# EAGLE design pcie-led-high (EAGLE 7.6.0)

## Sheet 1 of 2
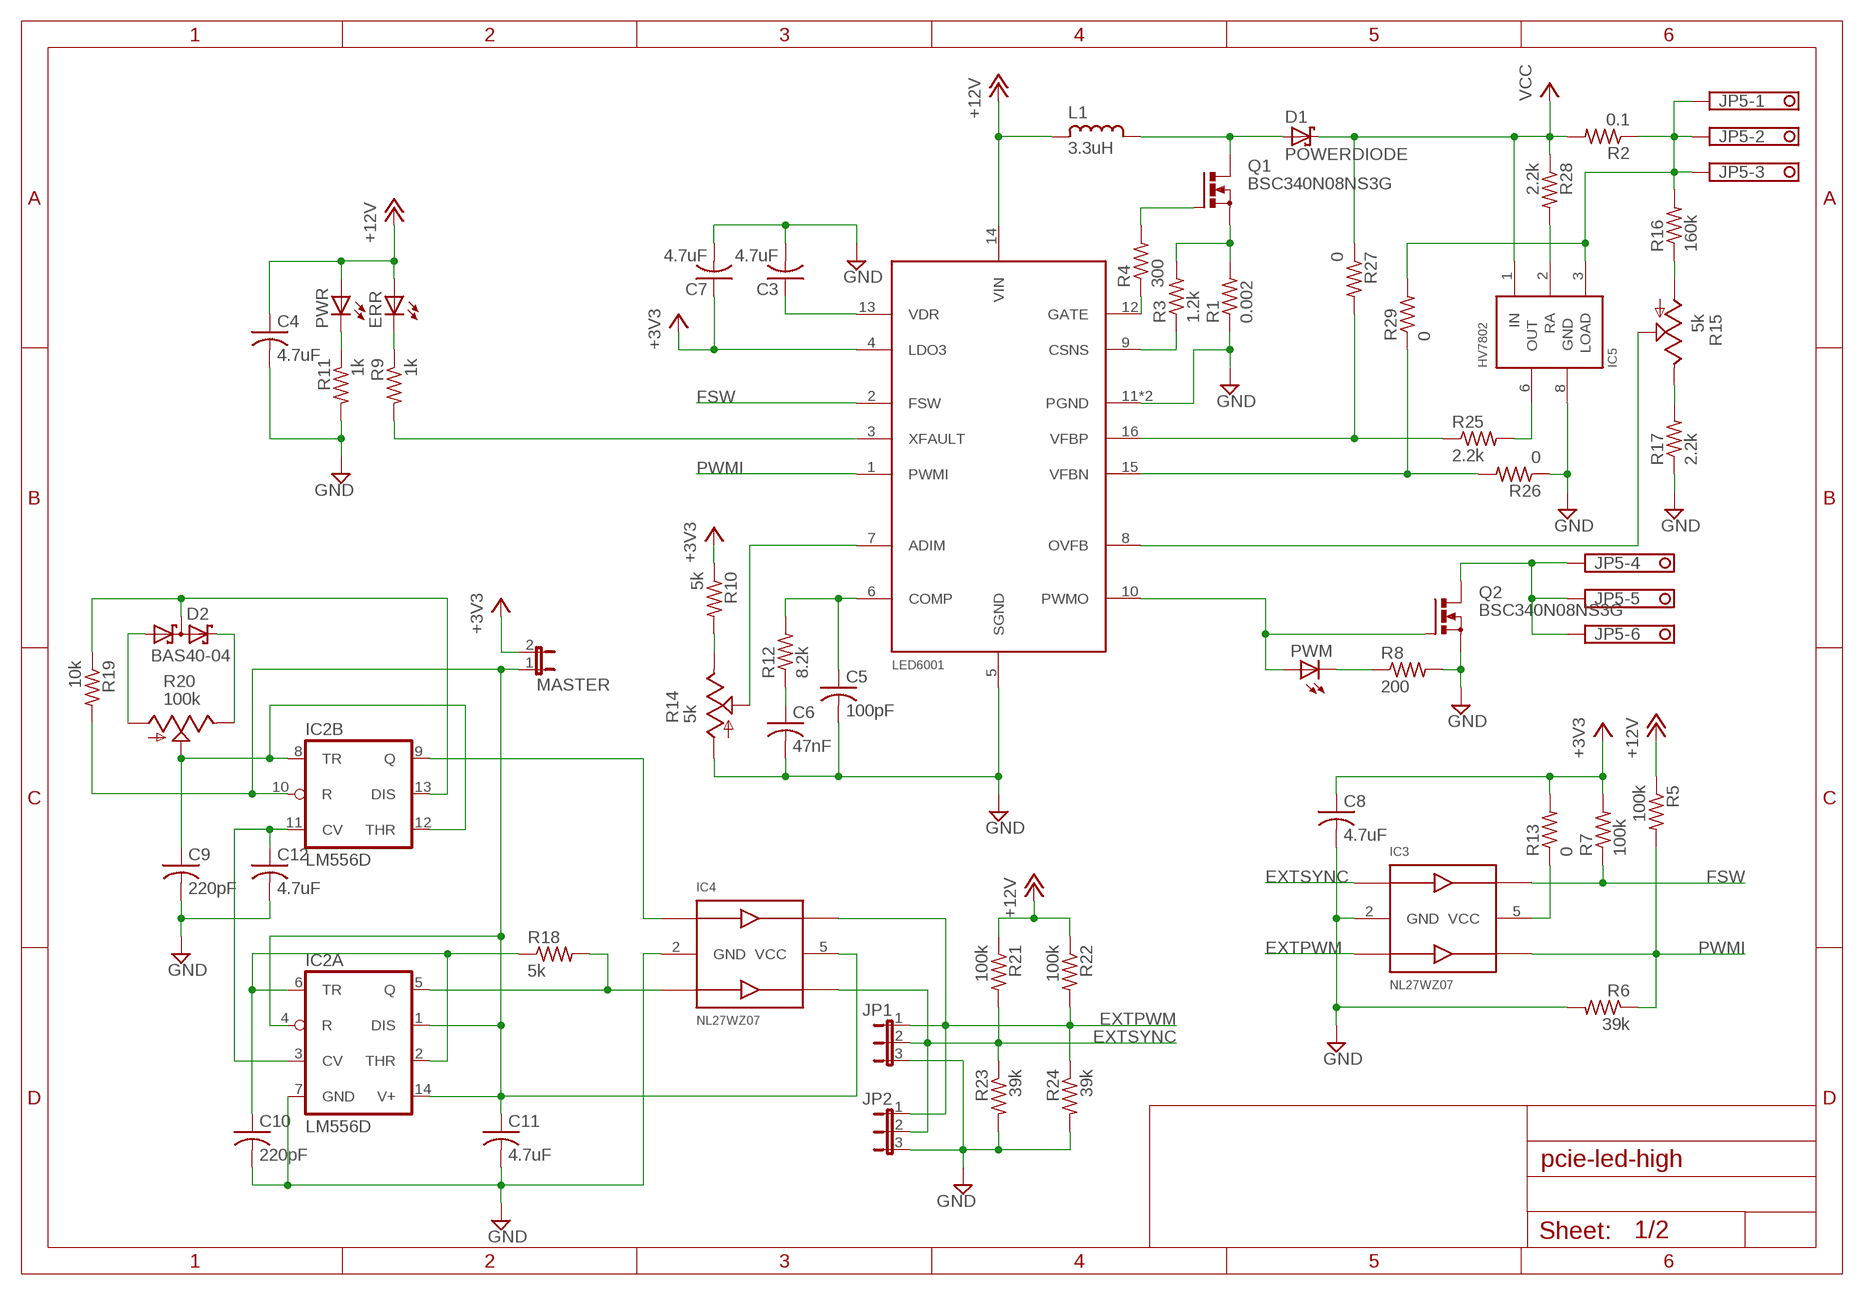
[diagram p0: schematic, sheet 1]

### Parts
C3  4.7uF  C-USC0603  [C0603]
C4  4.7uF  C-USC0603  [C0603]
C5  100pF  C-USC0603  [C0603]
C6  47nF  C-USC0603  [C0603]
C7  4.7uF  C-USC0603  [C0603]
C8  4.7uF  C-USC0603  [C0603]
C9  220pF  C-USC0603  [C0603]
C10  220pF  C-USC0603  [C0603]
C11  4.7uF  C-USC0603  [C0603]
C12  4.7uF  C-USC0603  [C0603]
D1  POWERDIODE  [LFPACK56-TO277]
D2  BAS40-04  [SOT23]
ERR  LEDCHIP-LED0805  [CHIP-LED0805]
IC1  LED6001  [HTSSOP-16]
IC2  LM556D  [SO14]
IC3  NL27WZ07  [SOT363]
IC4  NL27WZ07  [SOT363]
IC5  HV7802  [MSOP08]
JP1  JP2E  [JP2]
JP2  JP2E  [JP2]
JP5  OSTTE06  [OSTTE06]
L1  3.3uH  SRP1770TA  [SRP1770TA]
MASTER  JP1E  [JP1]
PWM  LEDCHIP-LED0805  [CHIP-LED0805]
PWR  LEDCHIP-LED0805  [CHIP-LED0805]
Q1  BSC340N08NS3G  [PG-TDSON-8]
Q2  BSC340N08NS3G  [PG-TDSON-8]
R1  0.002  R-US_R1206  [R1206]
R2  0.1  R-US_R2512  [R2512]
R3  1.2k  R-US_R0603  [R0603]
R4  300  R-US_R0603  [R0603]
R5  100k  R-US_R0603  [R0603]
R6  39k  R-US_R0603  [R0603]
R7  100k  R-US_R0603  [R0603]
R8  200  R-US_R0603  [R0603]
R9  1k  R-US_R0603  [R0603]
R10  5k  R-US_R0603  [R0603]
R11  1k  R-US_R0603  [R0603]
R12  8.2k  R-US_R0603  [R0603]
R13  0  R-US_R0603  [R0603]
R14  5k  ST4ETB  [ST-4EB]
R15  5k  ST4ETB  [ST-4EB]
R16  160k  R-US_R0603  [R0603]
R17  2.2k  R-US_R0603  [R0603]
R18  5k  R-US_R0603  [R0603]
R19  10k  R-US_R0603  [R0603]
R20  100k  P260T  [P260T]
R21  100k  R-US_R0603  [R0603]
R22  100k  R-US_R0603  [R0603]
R23  39k  R-US_R0603  [R0603]
R24  39k  R-US_R0603  [R0603]
R25  2.2k  R-US_R0603  [R0603]
R26  0  R-US_R0603  [R0603]
R27  0  R-US_R0603  [R0603]
R28  2.2k  R-US_R0603  [R0603]
R29  0  R-US_R0603  [R0603]

### Nets
+3V3: C7.1 C8.1 IC1.4(LDO3) MASTER.2 R7.2 R10.1 R13.2
+12V: C4.1 ERR.A IC1.14(VIN) L1.P$1 PWR.A R5.1 R21.1 R22.1 ; also sheet 2
CSNS: Q1.1(S) Q1.2(S) Q1.3(S) R1.2 R3.2
EXTPWM: IC3.3(IN2) IC4.6(OUT1) JP1.1 JP2.1 R22.2 R24.1
EXTSYNC: IC3.1(IN1) IC4.4(OUT2) JP1.2 JP2.2 R21.2 R23.1
FSW: IC1.2(FSW) IC3.6(OUT1) R7.1
GND: C3.2 C4.2 C5.2 C6.2 C7.2 C8.2 C9.2 C10.2 C11.2 C12.2 IC1.5(SGND) IC1.11(PGND) IC1.PAD(PGND) IC2.7(A:GND) IC3.2(GND) IC4.2(GND) IC5.8(GND) JP1.3 JP2.3 Q2.1(S) Q2.2(S) Q2.3(S) R1.1 R6.2 R8.2 R11.2 R14.1(A) R17.1 R23.2 R24.2 R26.1 ; also sheet 2
L+: D1.A L1.P$2 Q1.5(D) Q1.6(D) Q1.7(D) Q1.8(D) Q1.TH(D)
LED+: IC5.3(LOAD) JP5.1 JP5.2 JP5.3 R2.1 R16.2 R29.2
LED-: JP5.4 JP5.5 JP5.6 Q2.5(D) Q2.6(D) Q2.7(D) Q2.8(D) Q2.TH(D)
N$1: PWM.C R8.1
N$2: IC1.10(PWMO) PWM.A Q2.4(G)
N$3: Q1.4(G) R4.2
N$4: C11.1 IC2.1(A:DIS) IC2.4(A:R) IC2.10(B:R) IC2.14(A:V+) IC4.5(VCC) MASTER.1 R19.2
N$5: IC1.12(GATE) R4.1
N$6: IC2.5(A:Q) IC4.3(IN2) R18.2
N$7: R15.1(A) R16.1
N$8: IC2.9(B:Q) IC4.1(IN1)
N$9: C5.1 IC1.6(COMP) R12.2
N$10: C6.1 R12.1
N$11: IC1.8(OVFB) R15.2(S)
N$12: IC1.7(ADIM) R14.2(S)
N$13: R15.3(E) R17.2
N$14: R10.2 R14.3(E)
N$15: IC1.9(CSNS) R3.1
N$16: IC3.5(VCC) R13.1
N$17: IC5.6(OUT) R25.2
N$18: C12.1 IC2.3(A:CV) IC2.11(B:CV)
N$19: IC5.2(RA) R28.2
N$20: IC1.15(VFBN) R26.2 R29.1
N$21: C10.1 IC2.2(A:THR) IC2.6(A:TR) R18.1
N$22: ERR.C R9.1
N$23: D2.2(C2) R20.3(E)
N$24: D2.1(A1) R20.1(A)
N$25: C9.1 IC2.8(B:TR) IC2.12(B:THR) R20.2(S)
N$26: D2.3(C1A2) IC2.13(B:DIS) R19.1
N$27: PWR.C R11.1
N$29: C3.1 IC1.13(VDR)
PWMI: IC1.1(PWMI) IC3.4(OUT2) R5.2 R6.1
VCC: D1.C1(C) D1.C2(C) D1.C3(C) D1.C4(C) D1.TH(C) IC5.1(IN) R2.2 R27.1 R28.1 ; also sheet 2
VFBP: IC1.16(VFBP) R25.1 R27.2
XFAULT: IC1.3(XFAULT) R9.2

## Sheet 2 of 2
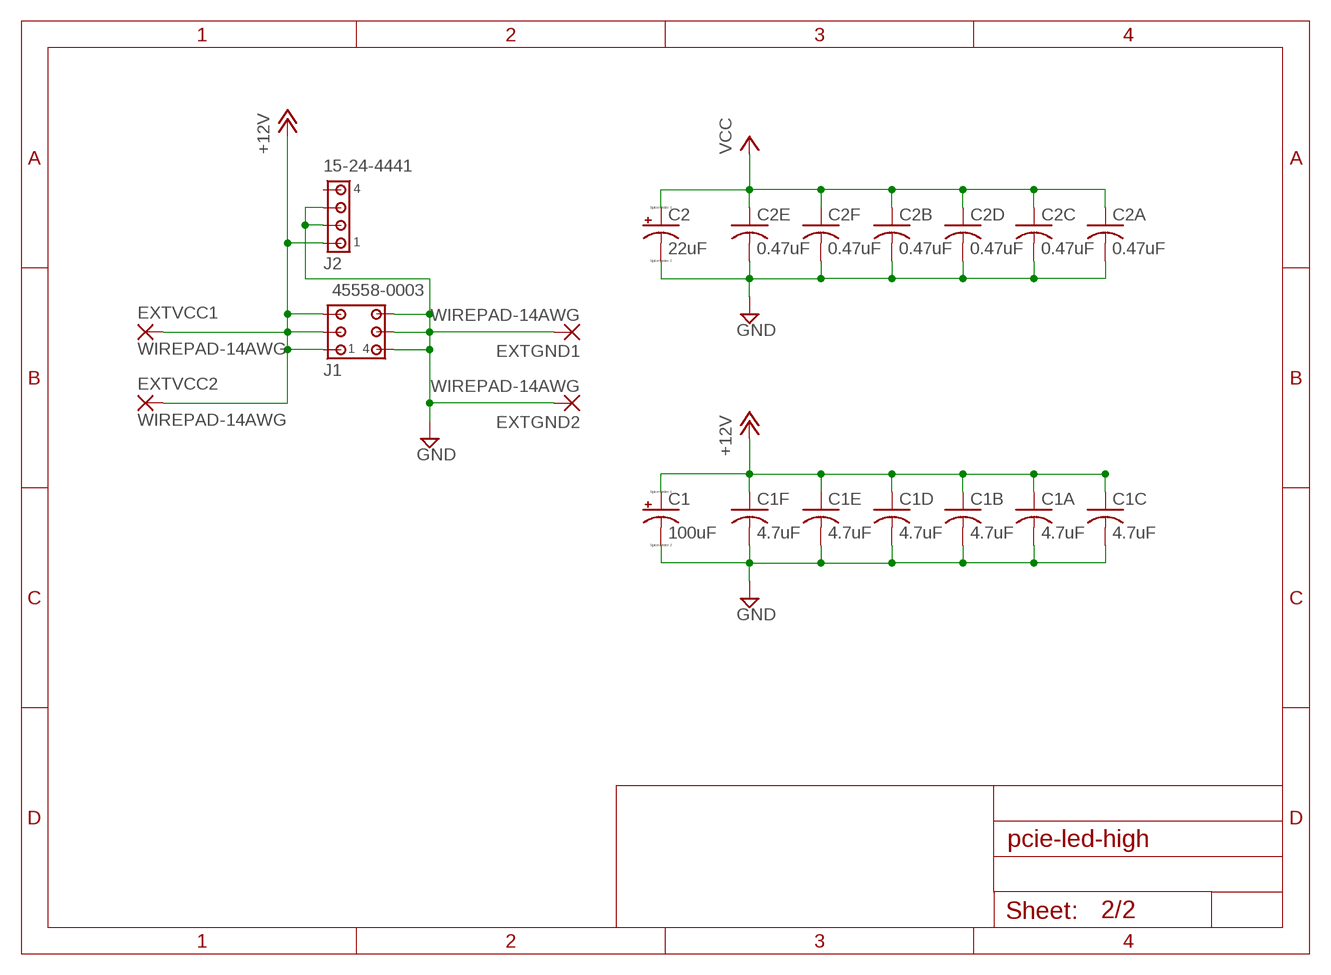
[diagram p1: schematic, sheet 2]

### Parts
C1  100uF  CPOL-USE3.5-8  [E3,5-8]
C1A  4.7uF  C-USC0805  [C0805]
C1B  4.7uF  C-USC0805  [C0805]
C1C  4.7uF  C-USC0805  [C0805]
C1D  4.7uF  C-USC0805  [C0805]
C1E  4.7uF  C-USC0805  [C0805]
C1F  4.7uF  C-USC0805  [C0805]
C2  22uF  CPOL-USE3.5-8  [E3,5-8]
C2A  0.47uF  C-USC0805  [C0805]
C2B  0.47uF  C-USC0805  [C0805]
C2C  0.47uF  C-USC0805  [C0805]
C2D  0.47uF  C-USC0805  [C0805]
C2E  0.47uF  C-USC0805  [C0805]
C2F  0.47uF  C-USC0805  [C0805]
EXTGND1  WIREPAD-14AWG  [WIREPAD-14AWG]
EXTGND2  WIREPAD-14AWG  [WIREPAD-14AWG]
EXTVCC1  WIREPAD-14AWG  [WIREPAD-14AWG]
EXTVCC2  WIREPAD-14AWG  [WIREPAD-14AWG]
J1  45558-0003  [45558-0003]
J2  15-24-4441  [15-24-4441]

### Nets
+12V: C1.+ C1A.1 C1B.1 C1C.1 C1D.1 C1E.1 C1F.1 EXTVCC1.TP(P) EXTVCC2.TP(P) J1.1 J1.2 J1.3 J2.1 ; also sheet 1
GND: C1.- C1A.2 C1B.2 C1C.2 C1D.2 C1E.2 C1F.2 C2.- C2A.2 C2B.2 C2C.2 C2D.2 C2E.2 C2F.2 EXTGND1.TP(P) EXTGND2.TP(P) J1.4 J1.5 J1.6 J2.2 J2.3 ; also sheet 1
VCC: C2.+ C2A.1 C2B.1 C2C.1 C2D.1 C2E.1 C2F.1 ; also sheet 1
Unconnected: J2.4

## Library data of the parts
C1 C2 = resistor:CPOL-US: POLARIZED CAPACITOR, American symbol
C1A C1B C1C C1D C1E C1F C2A C2B C2C C2D C2E C2F C3-C12 = resistor:C-US: CAPACITOR, American symbol
D1 = parts:POWERDIODE
D2 = diode:BAS40-04: Silicon Schottky Diodes General-purpose diode for high-speed switching
ERR PWM PWR = led:LED: LED OSRAM: - CHIPLED LG R971, LG N971, LY N971, LG Q971, LY Q971, LO R971, LY R971 LH N974, LH R974 LS Q976, LO Q976, LY Q976 LO Q996 - Hyper CHIPLED LW Q18S LB Q993, LB Q99A, LB R99A - SideLED LS A670, LO A670, LY A670, LG A670, LP A670 LB A673, LV A673, LT A673, LW A673 LH A674 LY A675 LS A676, LA A676, LO A676, LY A676, LW A676 LS A679, LY A679, LG A679 - Hyper Micro SIDELED® LS Y876, LA Y876, LO Y876, LY Y876 LT Y87S - SmartLED LW L88C, LW L88S LB L89C, LB L89S, LG L890 LS L89K, LO L89K, LY L89K LS L896, LA L896, LO L896, LY L896 - TOPLED LS T670, LO T670, LY T670, LG T670, LP T670 LSG T670, LSP T670, LSY T670, LOP T670, LYG T670 LG T671, LOG T671, LSG T671 LB T673, LV T673, LT T673, LW T673 LH T674 LS T676, LA T676, LO T676, LY T676, LB T676, LH T676, LSB T676, LW T676 LB T67C, LV T67C, LT T67C, LS T67K, LO T67K, LY T67K, LW E67C LS E67B, LA E67B, LO E67B, LY E67B, LB E67C, LV E67C, LT E67C LW T67C LS T679, LY T679, LG T679 LS T770, LO T770, LY T770, LG T770, LP T770 LB T773, LV T773, LT T773, LW T773 LH T774 LS E675, LA E675, LY E675, LS T675 LS T776, LA T776, LO T776, LY T776, LB T776 LHGB T686 LT T68C, LB T68C - Hyper Mini TOPLED® LB M676 - Mini TOPLED Santana® LG M470 LS M47K, LO M47K, LY M47K Source: http://www.osram.convergy.de LUXEON: - LUMILED® LXK2-PW12-R00, LXK2-PW12-S00, LXK2-PW14-U00, LXK2-PW14-V00 LXK2-PM12-R00, LXK2-PM12-S00, LXK2-PM14-U00 LXK2-PE12-Q00, LXK2-PE12-R00, LXK2-PE12-S00, LXK2-PE14-T00, LXK2-PE14-U00 LXK2-PB12-K00, LXK2-PB12-L00, LXK2-PB12-M00, LXK2-PB14-N00, LXK2-PB14-P00, LXK2-PB14-Q00 LXK2-PR12-L00, LXK2-PR12-M00, LXK2-PR14-Q00, LXK2-PR14-R00 LXK2-PD12-Q00, LXK2-PD12-R00, LXK2-PD12-S00 LXK2-PH12-R00, LXK2-PH12-S00 LXK2-PL12-P00, LXK2-PL12-Q00, LXK2-PL12-R00 Source: www.luxeon.com KINGBRIGHT: KA-3528ASYC Source: www.kingbright.com
EXTGND1 EXTGND2 EXTVCC1 EXTVCC2 = parts:WIREPAD-14AWG
IC1 = parts:LED6001: PWM-dimmable single channel LED driver with integrated boost controller
IC2 = linear:*556: Dual TIMER
IC3 IC4 = parts:NL27WZ07
IC5 = parts:HV7802
J1 = parts:45558-0003: Mini-Fit® Jr™ 45558 6 Positions Header, Shrouded Connector 0.165" (4.20mm) Through Hole, Right Angle Tin
J2 = parts:15-24-4441: 4 Positions Header, Shrouded Connector 0.200" (5.08mm) Through Hole, Right Angle Tin
JP1 JP2 = parts:JP2E: JUMPER
JP5 = parts:OSTTE06
L1 = parts:SRP1770TA: SRP1770TA Series - Shielded Power Inductors
MASTER = parts:JP1E: JUMPER
Q1 Q2 = parts:BSC340N08NS3G: OptiMOS TM 3 Power-Transistor BSC340N08NS3 G Source: Data sheet <http://www.infineon.com/dgdl/BSC340N08NS3G_rev2.4.pdf?folderId=db3a304313b8b5a60113cee8763b02d7&fileId=db3a30431add1d95011ae81c21f2563a>
R1-R13 R16-R19 R21-R29 = resistor:R-US_: RESISTOR, American symbol
R14 R15 = parts:ST4ETB
R20 = parts:P260T

## Board
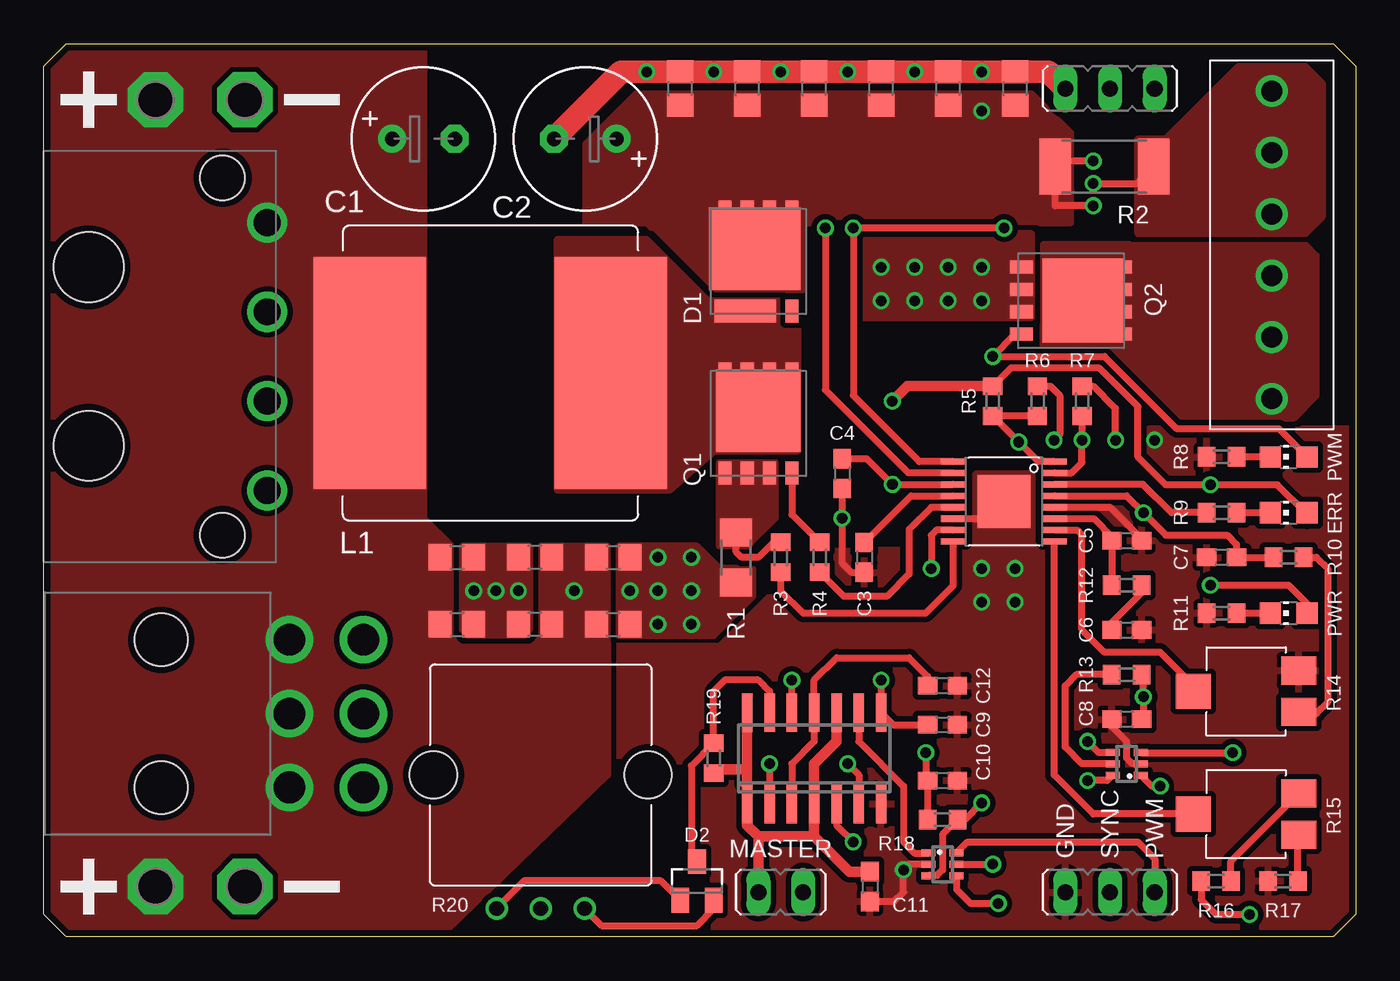
[diagram p2: board, top side]
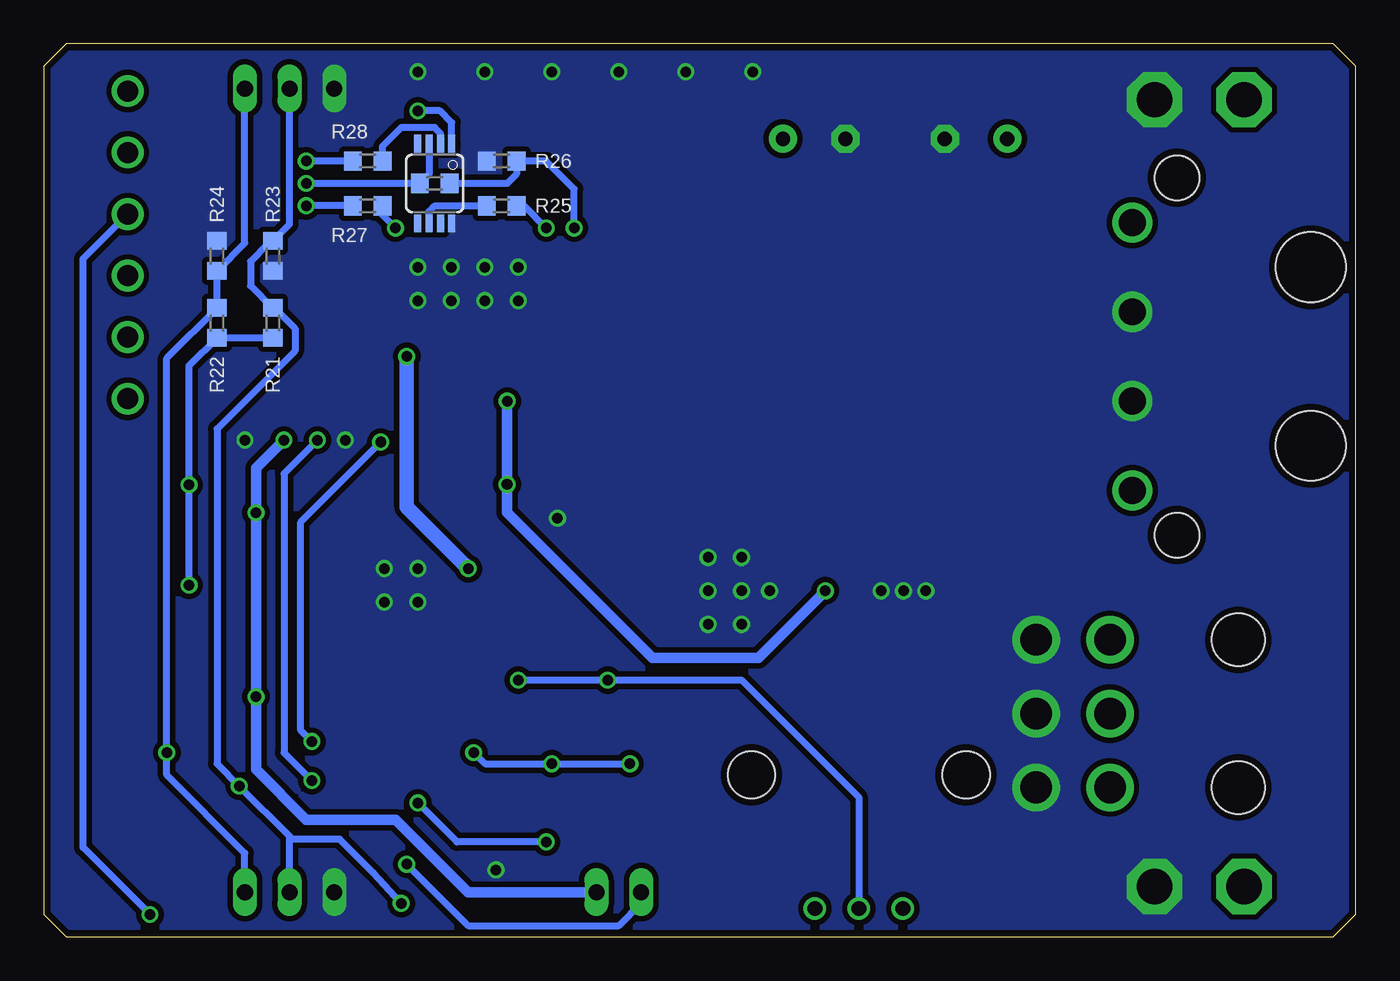
[diagram p3: board, bottom side, seen from below]

Size 74.61 x 50.8 mm. Coordinates in mm from the lower left corner, seen from the top.
Outline: 1.27,0 0,1.27 0,49.53 1.27,50.8 73.34,50.8 74.61,49.53 74.61,1.27 73.34,0 1.27,0
Copper layers (1*16): Top 0.0356mm / dielectric 1.5011mm / Bottom 0.0356mm
Design rules "oshpark-2layer": minimum track width 6mil, minimum drill 13mil, track to track 6mil, track to pad 6mil, pad to pad 6mil, via to via 6mil, smd to smd 6mil, copper to edge 15mil, drill to drill 6mil, minimum pad ring 7mil, minimum via ring 7mil, stop-mask expansion 2.5mil, vias tented up to drill 0mil, thermal gap 10mil

### Footprints (pad centres in the part's own frame; a part is rotated, then mirrored left to right if it is on the bottom)
E3,5-8 = drill 0.813 pad 1.6: + -1.778,0 | drill 0.813 pad 1.6 octagon: - 1.778,0
C0805 = smd 1.3 x 1.5: 1 -0.95,0; 2 0.95,0
C0603 = smd 1.1 x 1: 1 -0.85,0; 2 0.85,0
LFPACK56-TO277 = smd 1.3 x 3.5: A -2.825,0.735 | smd 1.3 x 0.75: C1 2.825,1.905; C2 2.825,0.635; C3 2.825,-0.635; C4 2.825,-1.905; NC -2.825,-1.905 | smd 4.7 x 5.2: TH 0.725,0.2
SOT23 = smd 1 x 1.4: 1 -0.95,-1.1; 2 0.95,-1.1; 3 0,1.1
CHIP-LED0805 = smd 1.2 x 1.2: A 0,-1.05; C 0,1.05
WIREPAD-14AWG = drill 2.007 pad 3.15 octagon: TP 0,0
HTSSOP-16 = smd 0.35 x 1.4: 1 -2.275,2.875; 2 -1.625,2.875; 3 -0.975,2.875; 4 -0.325,2.875; 5 0.325,2.875; 6 0.975,2.875; 7 1.625,2.875; 8 2.275,2.875; 9 2.275,-2.875; 10 1.625,-2.875; 11 0.975,-2.875; 12 0.325,-2.875; 13 -0.325,-2.875; 14 -0.975,-2.875; 15 -1.625,-2.875; 16 -2.275,-2.875 | smd 3 x 3: PAD 0,0
SO14 = smd 0.6 x 2.2: 1 -3.81,-2.6; 2 -2.54,-2.6; 3 -1.27,-2.6; 4 0,-2.6; 5 1.27,-2.6; 6 2.54,-2.6; 7 3.81,-2.6; 8 3.81,2.6; 9 2.54,2.6; 10 1.27,2.6; 11 0,2.6; 12 -1.27,2.6; 13 -2.54,2.6; 14 -3.81,2.6
SOT363 = smd 0.4 x 0.8: 1 -0.65,-0.8; 2 0,-0.8; 3 0.65,-0.8; 4 0.65,0.8; 5 0,0.8; 6 -0.65,0.8
MSOP08 = smd 0.4 x 1: 1 -0.976,-2.263; 2 -0.326,-2.263; 3 0.324,-2.263; 4 0.974,-2.263; 5 0.974,2.262; 6 0.324,2.262; 7 -0.326,2.262; 8 -0.976,2.262
45558-0003 = drill 1.8: 1 -4.2,0; 2 0,0; 3 4.2,0; 4 -4.2,-4.2; 5 0,-4.2; 6 4.2,-4.2 | hole 3: 4.2,7.3; -4.2,7.3
15-24-4441 = drill 1.524: 1 7.62,-5.08; 2 2.54,-5.08; 3 -2.54,-5.08; 4 -7.62,-5.08 | hole 2.54: 10.16,-2.54; -10.16,-2.54 | hole 3.988: 5.08,5.08; -5.08,5.08
JP2 = drill 0.914 long: 1 -2.54,0; 2 0,0; 3 2.54,0
OSTTE06 = drill 1.2: 1 -8.75,0; 2 -5.25,0; 3 -1.75,0; 4 1.75,0; 5 5.25,0; 6 8.75,0
SRP1770TA = smd 6.4 x 13.2: P$1 6.85,0; P$2 -6.85,0
JP1 = drill 0.914 long: 1 0,-1.27; 2 0,1.27
PG-TDSON-8 = smd 1.3 x 0.75: 1 -2.825,1.905; 2 -2.825,0.635; 3 -2.825,-0.635; 4 -2.825,-1.905; 5 2.825,-1.905; 6 2.825,-0.635; 7 2.825,0.635; 8 2.825,1.905 | smd 4.7 x 4.8: TH 0.725,0
R1206 = smd 1.6 x 1.803: 1 -1.422,0; 2 1.422,0
R2512 = smd 1.8 x 3.2: 1 -2.8,0; 2 2.8,0
R0603 = smd 1 x 1.1: 1 -0.85,0; 2 0.85,0
ST-4EB = smd 2 x 1.6: 1 2.8,1.175; 3 2.8,-1.175 | smd 2 x 2: 2 -3.2,0
P260T = drill 0.85: 1 -2.5,-7.6; 2 0,-7.6; 3 2.5,-7.6 | hole 2.7: -6.1,0; 6.1,0

### Placement (x,y rotation side)
C1  21.59,45.4 0 top
C1A  23.5,21.59 0 top
C1B  23.5,17.78 0 top
C1C  27.94,21.59 180 top
C1D  27.94,17.78 180 top
C1E  32.38,21.59 0 top
C1F  32.38,17.78 0 top
C2  30.8,45.4 180 top
C2A  36.2,48.26 90 top
C2B  40.01,48.26 90 top
C2C  43.81,48.26 90 top
C2D  47.62,48.26 90 top
C2E  51.44,48.26 90 top
C2F  55.24,48.26 90 top
C3  46.67,21.59 270 top
C4  45.4,26.35 270 top
C5  61.59,22.54 0 top
C6  61.59,17.46 0 top
C7  66.99,21.59 180 top
C8  61.59,12.38 180 top
C9  51.12,12.06 0 top
C10  51.12,8.89 0 top
C11  46.99,2.86 270 top
C12  51.12,14.29 0 top
D1  40.64,38.42 90 top
D2  37.15,3.17 0 top
ERR  70.8,24.13 90 top
EXTGND1  11.43,2.86 0 top
EXTGND2  11.43,47.62 0 top
EXTVCC1  6.35,2.86 0 top
EXTVCC2  6.35,47.62 0 top
IC1  54.61,24.77 270 top
IC2  43.81,10.16 0 top
IC3  61.59,9.84 90 top
IC4  51.12,4.13 270 top
IC5  52.39,42.86 180 bottom
J1  13.97,12.7 90 top
J2  7.62,33.02 90 top
JP1  60.64,48.26 180 top
JP2  60.64,2.54 180 top
JP5  69.85,39.37 270 top
L1  25.4,32.07 180 top
MASTER  41.91,2.54 270 top
PWM  70.8,27.3 90 top
PWR  70.8,18.41 90 top
Q1  40.64,29.21 90 top
Q2  58.42,36.2 0 top
R1  39.37,21.59 90 top
R2  60.33,43.81 180 top
R3  41.91,21.59 90 top
R4  44.13,21.59 90 top
R5  53.98,30.48 270 top
R6  56.52,30.48 90 top
R7  59.05,30.48 90 top
R8  66.99,27.3 180 top
R9  66.99,24.13 180 top
R10  70.8,21.59 0 top
R11  66.99,18.41 180 top
R12  61.59,20 180 top
R13  61.59,14.92 0 top
R14  68.58,13.97 0 top
R15  68.58,6.99 0 top
R16  66.67,3.17 180 top
R17  70.48,3.17 0 top
R18  51.12,6.67 0 top
R19  38.1,10.16 270 top
R20  28.26,9.21 0 top
R21  61.59,34.92 90 bottom
R22  64.77,34.92 90 bottom
R23  61.59,38.73 270 bottom
R24  64.77,38.73 90 bottom
R25  48.58,41.59 180 bottom
R26  48.58,44.13 0 bottom
R27  56.2,41.59 0 bottom
R28  56.2,44.13 0 bottom
R29  52.39,42.86 180 bottom

### Tracks (layer width: path | path; a pad name or v marks a point on that pad's centre or on a via)
+3V3  (via drill 0.6)
  Top 0.406: IC1.4 61.59,25.09 v62.55,24.13 63.82,22.86 67.31,22.86 67.84,22.33 C7.1 R10.1 | 59.16,31.33 R7.2 | 59.16,31.43 R7.2 | R7.2 59.69,31.33 60.96,30.06 v60.96,28.26 | C8.1 62.55,12.48 v62.55,13.65 62.55,14.82 R13.2
  Bottom 0.61: v60.96,28.26 62.55,26.67 v62.55,24.13 v62.55,13.65 62.55,9.53 59.69,6.67 54.61,6.67 50.48,2.54 MASTER.2
+12V  (via drill 0.6)
  Top 0.406: R5.1 55.03,32.38 60.01,32.38 62.23,30.16 62.23,27.3 63.82,25.72 v66.36,25.72 70.17,25.72 71.75,24.13 ERR.A 71.85,23.71 | PWR.A 71.85,18.95 70.8,20 v66.36,20 | 53.98,31.43 R5.1 | C4.1 46.8,27.2 v48.26,25.74 | R5.1 53.87,31.33 | v48.28,25.74 IC1.14
  Top 0.61: v48.26,30.48 49.11,31.33 R5.1
  Top 2.54: 18.92,35.69 L1.P$1
  Bottom 0.406: v66.36,20 v66.36,25.72 66.36,32.49 R22.1 R21.1
  Bottom 0.61: v30.16,19.68 33.97,15.88 40.01,15.88 48.26,24.13 v48.26,25.74 v48.28,25.74 48.26,25.76 v48.26,30.48
  pour Top (isolate 0.305, rank 2, no thermals): 32.07,22.23 32.07,9.21 22.86,0.32 0.32,0.32 0.32,50.48 21.59,50.48 21.59,23.81 23.18,22.23 23.18,17.14 23.81,16.51 27.62,16.51 28.26,17.14 28.26,22.23
CSNS
  Top 0.406: R3.2 41.49,22.44 40.64,21.59 39.69,21.59 39.37,21.91 R1.2
  pour Top (rank 2, no thermals): 38.42,26.99 41.59,26.99 41.59,23.81 40.01,22.23 38.42,22.23
EXTPWM  (via drill 0.6)
  Top 0.406: 63.18,2.86 JP2.1 63.18,4.45 62.23,5.4 52.54,5.4 IC4.6 | IC3.3 62.41,10.48 v67.63,10.48
  Bottom 0.406: JP2.1 63.18,4.76 67.63,9.21 v67.63,10.48 67.63,32.92 R22.2 R24.1 | R24.1 64.67,37.88 | R24.1 63.18,39.47 JP1.1
EXTSYNC  (via drill 0.6)
  Top 0.406: JP2.2 60.64,3.49 | IC3.1 63.02,8.57 v63.5,8.57 | IC4.4 51.92,2.69 52.7,1.91 v54.29,1.91
  Bottom 0.406: JP2.2 60.64,5.71 | 60.64,5.71 v63.5,8.57 64.77,9.84 64.77,28.89 60.33,33.34 60.33,34.61 61.49,35.77 R21.2 62.87,37.05 62.87,38.42 61.91,39.37 61.81,39.37 R23.1 60.64,40.54 JP1.2 | 60.64,5.71 60.48,5.56 57.78,5.56 55.88,3.65 v54.29,1.91
FSW  (via drill 0.6)
  Top 0.406: R7.1 v59.05,28.26 59.05,26.99 58.46,26.39 IC1.2 | 59.39,8.88 v59.37,8.89 60.49,8.89 IC3.6
  Bottom 0.406: v59.37,8.89 60.96,10.48 60.96,26.35 v59.05,28.26
GND  (via drill 0.6)
  Top 0.406: IC1.5 60.65,24.44 62.45,22.64 C5.2 | R6.2 57.25,31.33 57.78,30.8 57.78,28.57 v57.47,28.26 | IC3.2 61.91,9.84 61.59,10.16 61.59,11.11 60.74,11.96 C8.2 | IC4.2 49.21,4.13 v48.9,3.81 48.9,2.54 48.36,2.01 C11.2 | C4.2 v45.4,23.81 45.4,21.27 45.94,20.74 C3.2 | IC1.11 53.63,23.79 IC1.PAD
  Top 1.27: C2B.2 | JP1.3 57.15,49.21 C2F.2 C2E.2 C2D.2 C2C.2 C2B.2 | C2A.2 C2B.2 | C2.- 32.83,49.21 v34.29,49.21 C2A.2
  other vias: 34.92,21.59 36.83,21.59 36.83,19.68 36.83,17.78 34.92,17.78 34.92,19.68 33.34,19.68 24.45,19.68 25.72,19.68 26.99,19.68 53.34,20.95 55.24,20.95 55.24,19.05 53.34,19.05 63.18,28.26 38.1,49.21 41.91,49.21 45.72,49.21 49.53,49.21 53.34,49.21 47.62,38.1 49.53,38.1 51.44,38.1 53.34,38.1 53.34,36.2 51.44,36.2 49.53,36.2 47.62,36.2
  pour Top (isolate 0.305, no thermals): 40.32,20.95 38.42,20.95 37.15,22.23 32.7,22.23 32.7,17.14 38.1,17.14 40.32,19.37
  pour Top (rank 3, no thermals): 53.02,26.35 56.2,26.35 56.2,21.91 53.02,21.91
  pour Top (no thermals): 23.81,22.23 27.62,22.23 27.62,17.46 27.3,17.14 24.13,17.14 23.81,17.46
  pour Top (isolate 0.305, rank 3): 74.3,0.32 74.3,28.89 62.87,28.89 57.78,22.23 43.81,21.91 38.42,16.51 32.38,16.51 32.38,8.89 23.81,0.32
  pour Bottom (isolate 0.305, no thermals): 74.3,0.32 0.32,0.32 0.32,50.48 74.3,50.48
  pour Top (isolate 0.305, no thermals): 56.2,35.24 56.2,40.01 46.35,40.01 46.35,35.24
L+
  pour Top (isolate 0.305, no thermals): 42.86,36.2 42.86,27.62 38.1,27.62 35.56,25.4 29.21,25.4 29.21,39.69 34.29,39.69 37.78,36.2
LED+  (via drill 0.6)
  Top 0.406: v59.69,42.86 62.17,42.86 R2.1 | R16.2 65.83,2.12 66.67,1.27 v68.58,1.27
  Bottom 0.406: IC5.3 52.71,43.39 R29.2 v59.69,42.86 | v68.58,1.27 72.39,5.08 72.39,38.58 JP5.3
  pour Top (isolate 0.305, no thermals): 62.23,45.4 63.82,45.4 67.94,49.53 71.75,49.53 72.71,48.58 72.71,40.96 71.75,40.01 62.23,40.01
LED-
  pour Top (isolate 0.305, rank 2, no thermals): 56.83,39.37 56.83,29.53 71.12,29.53 72.39,30.8 72.39,38.73 71.75,39.37
N$1
  Top 0.406: PWM.C R8.1
N$2  (via drill 0.6)
  Top 0.406: PWM.A 70.27,28.89 64.45,28.89 60.33,33.02 v53.98,33.02 55.24,34.29 Q2.4 | IC1.10 50.76,23.14 50.48,22.86 v50.48,20.95
  Bottom 0.813: v53.98,33.02 53.98,24.45 v50.48,20.95
N$3
  Top 0.406: Q1.4 42.55,24.03 R4.2
N$4  (via drill 0.6)
  Top 0.406: 39.79,8.68 40.01,8.89 | 39.96,12.8 IC2.14 | C11.1 46.67,3.39 | IC4.5 v53.98,4.13
  Top 0.61: IC2.14 40.01,9.53 | 40.01,9.53 40.01,8.89 IC2.1 40.01,6.35 40.64,5.71 | 43.81,5.71 40.64,5.71 | IC2.10 45.09,11.11 43.81,9.84 IC2.4 43.81,5.71 | MASTER.1 40.64,5.71 | 43.81,5.71 45.82,3.71 C11.1 | R19.2 38.31,9.53 40.01,9.53
  Bottom 0.406: v53.98,4.13 50.48,0.64 41.91,0.64 40.64,1.91 MASTER.1
N$5
  Top 0.406: IC1.12 50.48,24.44 49.21,23.18 49.21,20.64 47.94,19.37 45.51,19.37 R4.1
N$6  (via drill 0.6)
  Top 0.406: IC4.3 50.33,3.49 50.8,3.49 51.12,3.81 51.12,5.82 R18.2 52.39,6.67 v53.34,7.62 | IC2.5 45.09,6.35 v46.04,5.4
  Bottom 0.406: v46.04,5.4 51.12,5.4 v53.34,7.62
N$7
  Top 0.406: R16.1 67.53,4.3 R15.1
N$8
  Top 0.406: IC2.9 46.35,11.11 48.9,8.57 48.9,5.4 49.53,4.76 50.3,4.76 IC4.1
N$9
  Top 0.406: IC1.6 59.71,23.79 60.74,22.76 C5.1 R12.2
N$10
  Top 0.406: C6.1 60.74,17.88 62.45,19.58 R12.1
N$11
  Top 0.406: R15.2 59.69,6.99 57.47,9.21 57.47,21.2 IC1.8
N$12
  Top 0.406: IC1.7 58.77,23.14 59.05,22.86 59.05,17.46 60.33,16.19 63.5,16.19 65.38,14.31 R14.2
N$13
  Top 0.406: R17.2 71.33,5.76 R15.3
N$14
  Top 0.406: R14.3 71.47,12.7 72.39,12.7 73.03,13.34 73.03,20.95 72.39,21.59 R10.2
N$15
  Top 0.406: R3.1 41.91,19.68 43.18,18.41 50.16,18.41 51.73,19.98 IC1.9
N$16
  Top 0.406: IC3.5 59.05,9.84 58.1,10.79 58.1,14.29 58.74,14.92 R13.1
N$17
  Bottom 0.406: IC5.6 52.71,41.27 52.39,41.59 R25.2
N$18
  Top 0.406: IC2.3 42.55,9.84 43.81,11.11 IC2.11 43.81,14.61 45.09,15.88 49.21,15.88 50.27,14.82 C12.1
N$19
  Bottom 0.406: IC5.2 52.07,45.72 52.39,46.04 54.29,46.04 55.35,44.98 R28.2
N$20  (via drill 0.6)
  Top 0.406: IC1.15 49.17,26.39 44.45,31.11 v44.45,40.32
  Bottom 0.406: 51.33,42.86 R29.1 48.26,42.86 47.73,43.4 R26.2 46.04,44.13 44.45,42.55 v44.45,40.32
N$21  (via drill 0.6)
  Top 0.406: v41.27,9.84 IC2.2 | v45.72,9.84 46.35,9.21 IC2.6 | v50.16,10.48 50.16,8.99 C10.1 R18.1
  Bottom 0.406: v41.27,9.84 v45.72,9.84 49.53,9.84 v50.16,10.48
N$22
  Top 0.406: R9.1 ERR.C
N$23
  Top 0.406: R20.3 31.73,0.64 37.15,0.64 38.1,1.58 D2.2
N$24
  Top 0.406: D2.1 35.1,3.17 27.3,3.17 25.76,1.63 R20.1
N$25  (via drill 0.6)
  Top 0.406: IC2.12 v42.55,14.61 | v47.62,14.61 IC2.8 48.32,12.06 C9.1
  Bottom 0.406: v47.62,14.61 v42.55,14.61 34.92,14.61 28.26,7.94 R20.2
N$26
  Top 0.406: IC2.13 41.27,13.97 40.64,14.61 38.73,14.61 38.1,13.97 R19.1 36.83,9.74 36.83,4.59 D2.3
N$27
  Top 0.406: R11.1 PWR.C
N$29
  Top 0.406: C3.1 49.32,25.09 IC1.13
PWMI  (via drill 0.6)
  Top 0.406: R6.1 R5.2 v55.45,28.15 56.56,27.04 IC1.1 | v59.37,11.11 59.99,10.49 IC3.4
  Bottom 0.406: v55.45,28.15 60.01,23.6 60.01,11.75 v59.37,11.11
VCC  (via drill 0.6)
  Top 0.406: 40.82,38.76 D1.TH | v59.69,44.13 57.84,44.13 R2.2 57.52,41.59 v59.69,41.59
  Bottom 0.406: R27.1 v59.69,41.59 | R28.1 v59.69,44.13 | IC5.1 51.41,46.33 52.07,46.99 v53.34,46.99
  pour Top (isolate 0.305, rank 2, no thermals): 43.18,36.83 43.18,40.64 58.42,40.64 58.42,45.72 56.2,47.94 33.66,47.94 30.8,45.09 30.8,40.64 34.29,40.64 38.1,36.83
VFBP  (via drill 0.6)
  Top 0.406: IC1.16 49.8,27.04 46.04,30.8 v46.04,40.32 v54.61,40.32
  Bottom 0.406: R25.1 47.31,41.59 v46.04,40.32 | R27.2 55.35,41.06 v54.61,40.32
XFAULT
  Top 0.406: R9.2 64.14,24.13 62.52,25.74 IC1.3

### Text on the board
tPlace: GND | SYNC | PWM
bStop: PCIe LED Driver / Rev Alpha / 11/23/2016